# EAGLE schematic board (EAGLE 7.2.0)
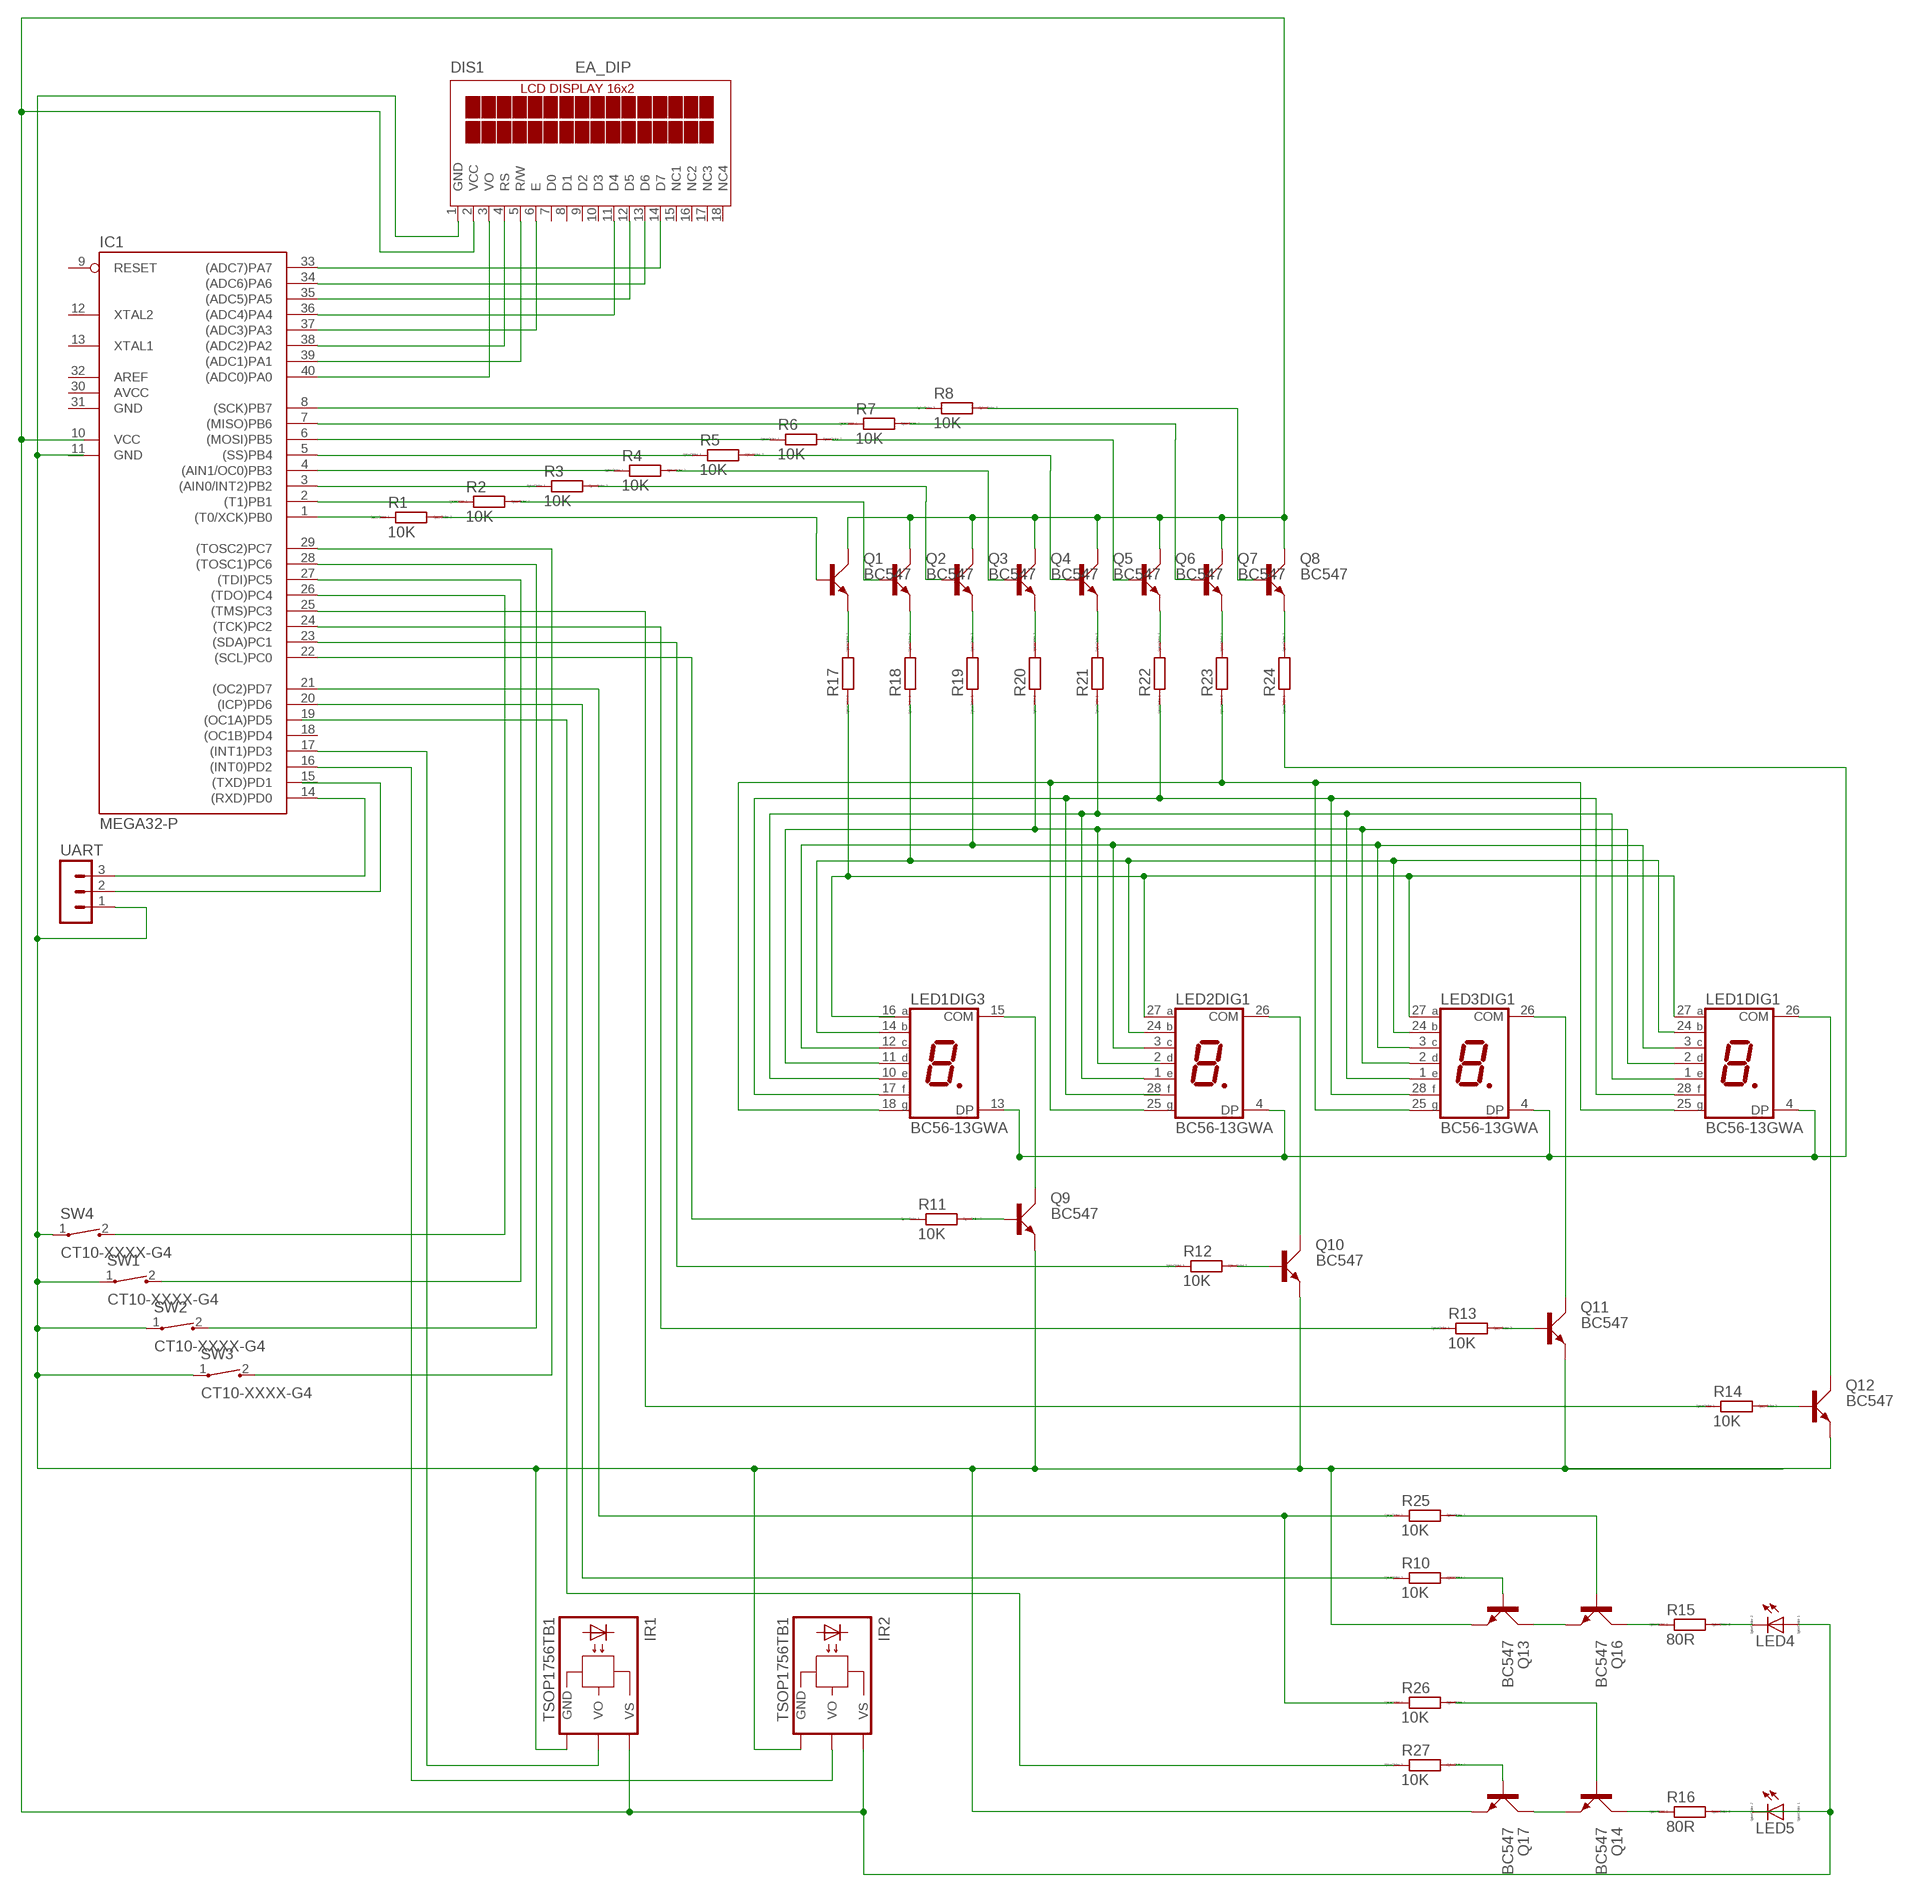
[diagram p0: schematic, sheet 1]

## Parts
DIS1  EA_DIP  [EA_DIP]
IC1  MEGA32-P  [DIL40]
IR1  TSOP1756TB1  [TSOP17_TB1]
IR2  TSOP1756TB1  [TSOP17_TB1]
LED1  BC56-13GWA  [BA/BC56]
LED2  BC56-13GWA  [BA/BC56]
LED3  BC56-13GWA  [BA/BC56]
LED4  LED_E  [LED_1206]
LED5  LED_E  [LED_1206]
Q1  BC547  [SOT54A]
Q2  BC547  [SOT54A]
Q3  BC547  [SOT54A]
Q4  BC547  [SOT54A]
Q5  BC547  [SOT54A]
Q6  BC547  [SOT54A]
Q7  BC547  [SOT54A]
Q8  BC547  [SOT54A]
Q9  BC547  [SOT54A]
Q10  BC547  [SOT54A]
Q11  BC547  [SOT54A]
Q12  BC547  [SOT54A]
Q13  BC547  [SOT54A]
Q14  BC547  [SOT54A]
Q16  BC547  [SOT54A]
Q17  BC547  [SOT54A]
R1  10K  R0204/7  [0204/7]
R2  10K  R0204/7  [0204/7]
R3  10K  R0204/7  [0204/7]
R4  10K  R0204/7  [0204/7]
R5  10K  R0204/7  [0204/7]
R6  10K  R0204/7  [0204/7]
R7  10K  R0204/7  [0204/7]
R8  10K  R0204/7  [0204/7]
R10  10K  R0204/7  [0204/7]
R11  10K  R0204/7  [0204/7]
R12  10K  R0204/7  [0204/7]
R13  10K  R0204/7  [0204/7]
R14  10K  R0204/7  [0204/7]
R15  80R  R0204/7  [0204/7]
R16  80R  R0204/7  [0204/7]
R17  R0204/7  [0204/7]
R18  R0204/7  [0204/7]
R19  R0204/7  [0204/7]
R20  R0204/7  [0204/7]
R21  R0204/7  [0204/7]
R22  R0204/7  [0204/7]
R23  R0204/7  [0204/7]
R24  R0204/7  [0204/7]
R25  10K  R0204/7  [0204/7]
R26  10K  R0204/7  [0204/7]
R27  10K  R0204/7  [0204/7]
SW1  CT10-XXXX-G4  [CT10-XXXX-G4]
SW2  CT10-XXXX-G4  [CT10-XXXX-G4]
SW3  CT10-XXXX-G4  [CT10-XXXX-G4]
SW4  CT10-XXXX-G4  [CT10-XXXX-G4]
UART  MA03-1  [MA03-1]

## Nets
N$1: UART.2
N$2: IC1.14((RXD)PD0) UART.3
N$3: Q16.B R25.2
N$4: DIS1.11(D4) IC1.36((ADC4)PA4)
N$5: DIS1.12(D5) IC1.35((ADC5)PA5)
N$6: DIS1.13(D6) IC1.34((ADC6)PA6)
N$7: DIS1.14(D7) IC1.33((ADC7)PA7)
N$8: DIS1.5(R/W) IC1.39((ADC1)PA1)
N$9: DIS1.4(RS) IC1.38((ADC2)PA2)
N$10: DIS1.6(E) IC1.37((ADC3)PA3)
N$11: IC1.1((T0/XCK)PB0) R1.1
N$12: DIS1.3(VO) IC1.40((ADC0)PA0)
N$13: DIS1.2(VCC) IR1.VS IR2.VS LED4.A LED5.C Q1.C Q2.C Q3.C Q4.C Q5.C Q6.C Q7.C Q8.C R2.2
N$14: IC1.2((T1)PB1) R2.1
N$15: Q3.B R3.2
N$16: Q4.B R4.2
N$17: Q5.B R5.2
N$18: Q6.B R6.2
N$19: Q7.B R7.2
N$20: Q8.B R8.2
N$21: LED1.16(DIG3:A) LED1.27(DIG1:A) LED2.27(DIG1:A) LED3.27(DIG1:A) R17.1
N$22: LED1.2(DIG1:D) LED1.11(DIG3:D) LED2.2(DIG1:D) LED3.2(DIG1:D) R20.1
N$23: Q2.B
N$24: LED1.14(DIG3:B) LED1.24(DIG1:B) LED2.24(DIG1:B) LED3.24(DIG1:B) R18.1
N$25: Q1.B R1.2
N$26: LED1.3(DIG1:C) LED1.12(DIG3:C) LED2.3(DIG1:C) LED3.3(DIG1:C) R19.1
N$27: LED1.18(DIG3:G) LED1.25(DIG1:G) LED2.25(DIG1:G) LED3.25(DIG1:G) R23.1
N$28: LED1.1(DIG1:E) LED1.10(DIG3:E) LED2.1(DIG1:E) LED3.1(DIG1:E) R21.1
N$29: IC1.22((SCL)PC0) R11.1
N$30: IC1.3((AIN0/INT2)PB2) R3.1
N$31: IC1.4((AIN1/OC0)PB3) R4.1
N$32: IC1.5((SS)PB4) R5.1
N$33: IC1.6((MOSI)PB5) R6.1
N$34: IC1.23((SDA)PC1) R12.1
N$35: LED1.4(DIG1:DP) LED1.13(DIG3:DP) LED2.4(DIG1:DP) LED3.4(DIG1:DP) R24.1
N$36: LED1.15(DIG3:COM) Q9.C
N$37: LED2.26(DIG1:COM) Q10.C
N$38: LED3.26(DIG1:COM) Q11.C
N$39: LED1.26(DIG1:COM) Q12.C
N$40: IC1.24((TCK)PC2) R13.1
N$41: IC1.25((TMS)PC3) R14.1
N$42: IC1.21((OC2)PD7) R25.1 R26.1
N$43: Q14.B R26.2
N$44: DIS1.1(GND) IR1.GND IR2.GND Q9.E Q10.E Q11.E Q12.E Q13.E Q17.E SW1.1 SW2.1 SW3.1 SW4.1 UART.1
N$45: Q14.C R16.1
N$46: IC1.16((INT0)PD2) IR2.VO
N$47: IC1.17((INT1)PD3) IR1.VO
N$48: LED1.17(DIG3:F) LED1.28(DIG1:F) LED2.28(DIG1:F) LED3.28(DIG1:F) R22.1
N$49: IC1.7((MISO)PB6) R7.1
N$50: IC1.8((SCK)PB7) R8.1
N$51: Q14.E Q17.C
N$52: Q13.B R10.2
N$53: Q9.B R11.2
N$54: Q11.B R13.2
N$55: Q10.B R12.2
N$56: Q12.B R14.2
N$57: LED4.C R15.2
N$58: LED5.A R16.2
N$59: Q1.E R17.2
N$60: Q2.E R18.2
N$61: Q3.E R19.2
N$62: Q4.E R20.2
N$63: Q5.E R21.2
N$64: Q6.E R22.2
N$65: Q7.E R23.2
N$66: Q8.E R24.2
N$67: Q17.B R27.2
N$68: IC1.20((ICP)PD6) R10.1
N$69: R27.1
N$70: IC1.29((TOSC2)PC7) SW3.2
N$71: IC1.28((TOSC1)PC6) SW2.2
N$72: IC1.27((TDI)PC5) SW1.2
N$73: IC1.26((TDO)PC4) SW4.2
N$75: Q16.C R15.1
N$76: Q13.C Q16.E
Unconnected: DIS1.7(D0) DIS1.8(D1) DIS1.9(D2) DIS1.10(D3) DIS1.15(NC1) DIS1.16(NC2) DIS1.17(NC3) DIS1.18(NC4) IC1.9(RESET) IC1.12(XTAL2) IC1.13(XTAL1) IC1.15((TXD)PD1) IC1.18((OC1B)PD4) IC1.19((OC1A)PD5) IC1.32(AREF) LED1.5(DIG2:E) LED1.6(DIG2:D) LED1.7(DIG2:C) LED1.8(DIG2:COM) LED1.9(DIG2:DP) LED1.19(DIG2:B) LED1.20(DIG2:G) LED1.21(DIG2:COM) LED1.22(DIG2:A) LED1.23(DIG2:F) LED2.5(DIG2:E) LED2.6(DIG2:D) LED2.7(DIG2:C) LED2.8(DIG2:COM) LED2.9(DIG2:DP) LED2.10(DIG3:E) LED2.11(DIG3:D) LED2.12(DIG3:C) LED2.13(DIG3:DP) LED2.14(DIG3:B) LED2.15(DIG3:COM) LED2.16(DIG3:A) LED2.17(DIG3:F) LED2.18(DIG3:G) LED2.19(DIG2:B) LED2.20(DIG2:G) LED2.21(DIG2:COM) LED2.22(DIG2:A) LED2.23(DIG2:F) LED3.5(DIG2:E) LED3.6(DIG2:D) LED3.7(DIG2:C) LED3.8(DIG2:COM) LED3.9(DIG2:DP) LED3.10(DIG3:E) LED3.11(DIG3:D) LED3.12(DIG3:C) LED3.13(DIG3:DP) LED3.14(DIG3:B) LED3.15(DIG3:COM) LED3.16(DIG3:A) LED3.17(DIG3:F) LED3.18(DIG3:G) LED3.19(DIG2:B) LED3.20(DIG2:G) LED3.21(DIG2:COM) LED3.22(DIG2:A) LED3.23(DIG2:F)

## Power pins joined to a net without a drawn wire
AVCC: IC1.30(AVCC)
GND: IC1.11(GND) IC1.31(GND)
VCC: IC1.10(VCC)

## Library data of the parts
DIS1 = display-lcd:EA_DIP: LCD-MODUL 2x16 - 6,68mm, INKL. KONTROLLER HD44780 Source: Data sheet <http://www.lcd-module.de/pdf/doma/dip162-d.pdf>
IC1 = atmel:MEGA32-P: MICROCONTROLLER 32 Kbytes FLASH 2 Kbytes SRAM 1 Kbytes EEPROM USART 8-channel 10 bit ADC Source: www.atmel.com .. doc2503.pdf; MPN: ATMEGA32-16PU; OC_FARNELL: 1661729; OC_NEWARK: 51P1794
IR1 IR2 = telefunken:TSOP17*TB1: TSOP17..TB1 IR Receiver Modules for Remote Control Systems Source: http://www.vishay.com/docs/82042/82042.pdf; OC_FARNELL: unknown; OC_NEWARK: unknown
LED1-LED3 = display-kingbright:B?56-13*WA: 14.22mm (0.56INCH) THREE DIGIT NUMERIC DISPLAY Source: http://www.kingbright.com .. BA56-11EWA(Ver1189474895.pdf; OC_FARNELL: unknown; OC_NEWARK: unknown
LED4 LED5 = eagle-ltspice:LED_E: LED Source: http://www.osram.convergy.de Source: www.luxeon.com Source: www.kingbright.com; SPICEMODEL: NONE; SPICEPREFIX: D; SPICETYPE: diode
Q1-Q14 Q16 Q17 = transistor-small-signal:BC547: NPN TRANSISTOR
R1-R8 R10-R27 = eagle-ltspice:R: RESISTOR, European symbol; SPICEMODEL: NONE; SPICEPREFIX: R
SW1-SW4 = switch-coto:CT10-XXXX-: CT10 Series Molded Switch Source: www.cotorelay.com .. Coto_Technology__CT10-1530-G1.pdf
UART = con-lstb:MA03-1: PIN HEADER; OC_FARNELL: unknown; OC_NEWARK: unknown